# EAGLE design Ardumouse_test (EAGLE 7.6.0)
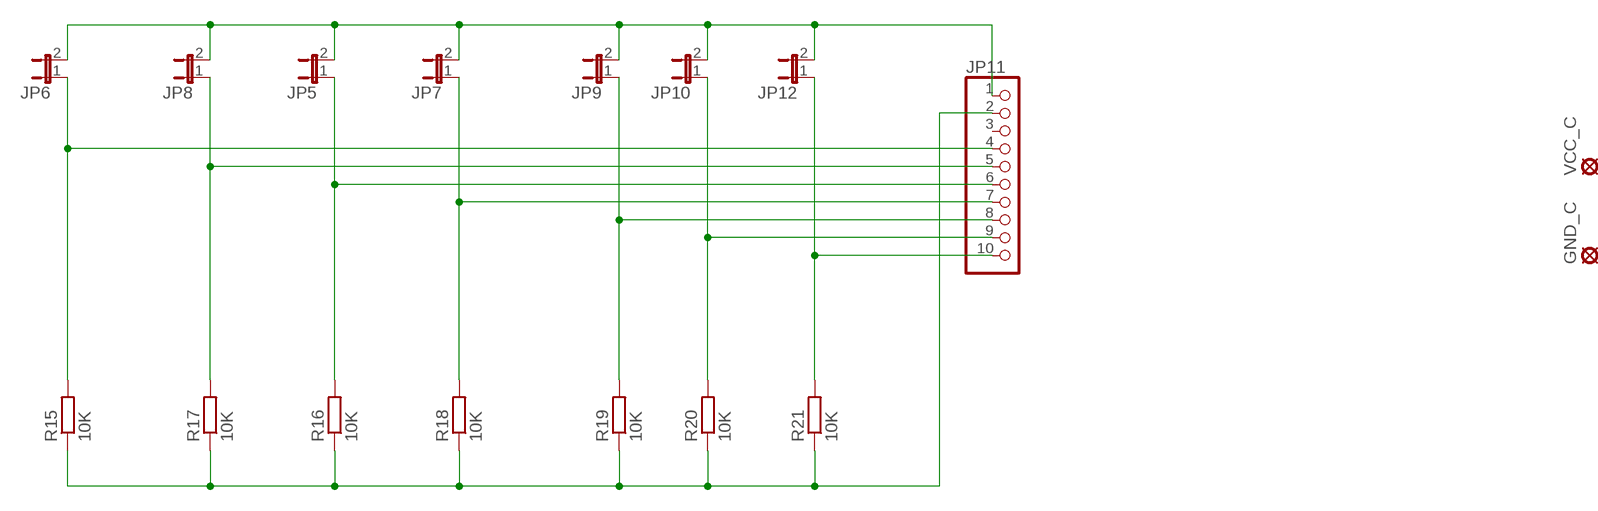
[diagram p0: schematic, sheet 1, part 1 of 2]
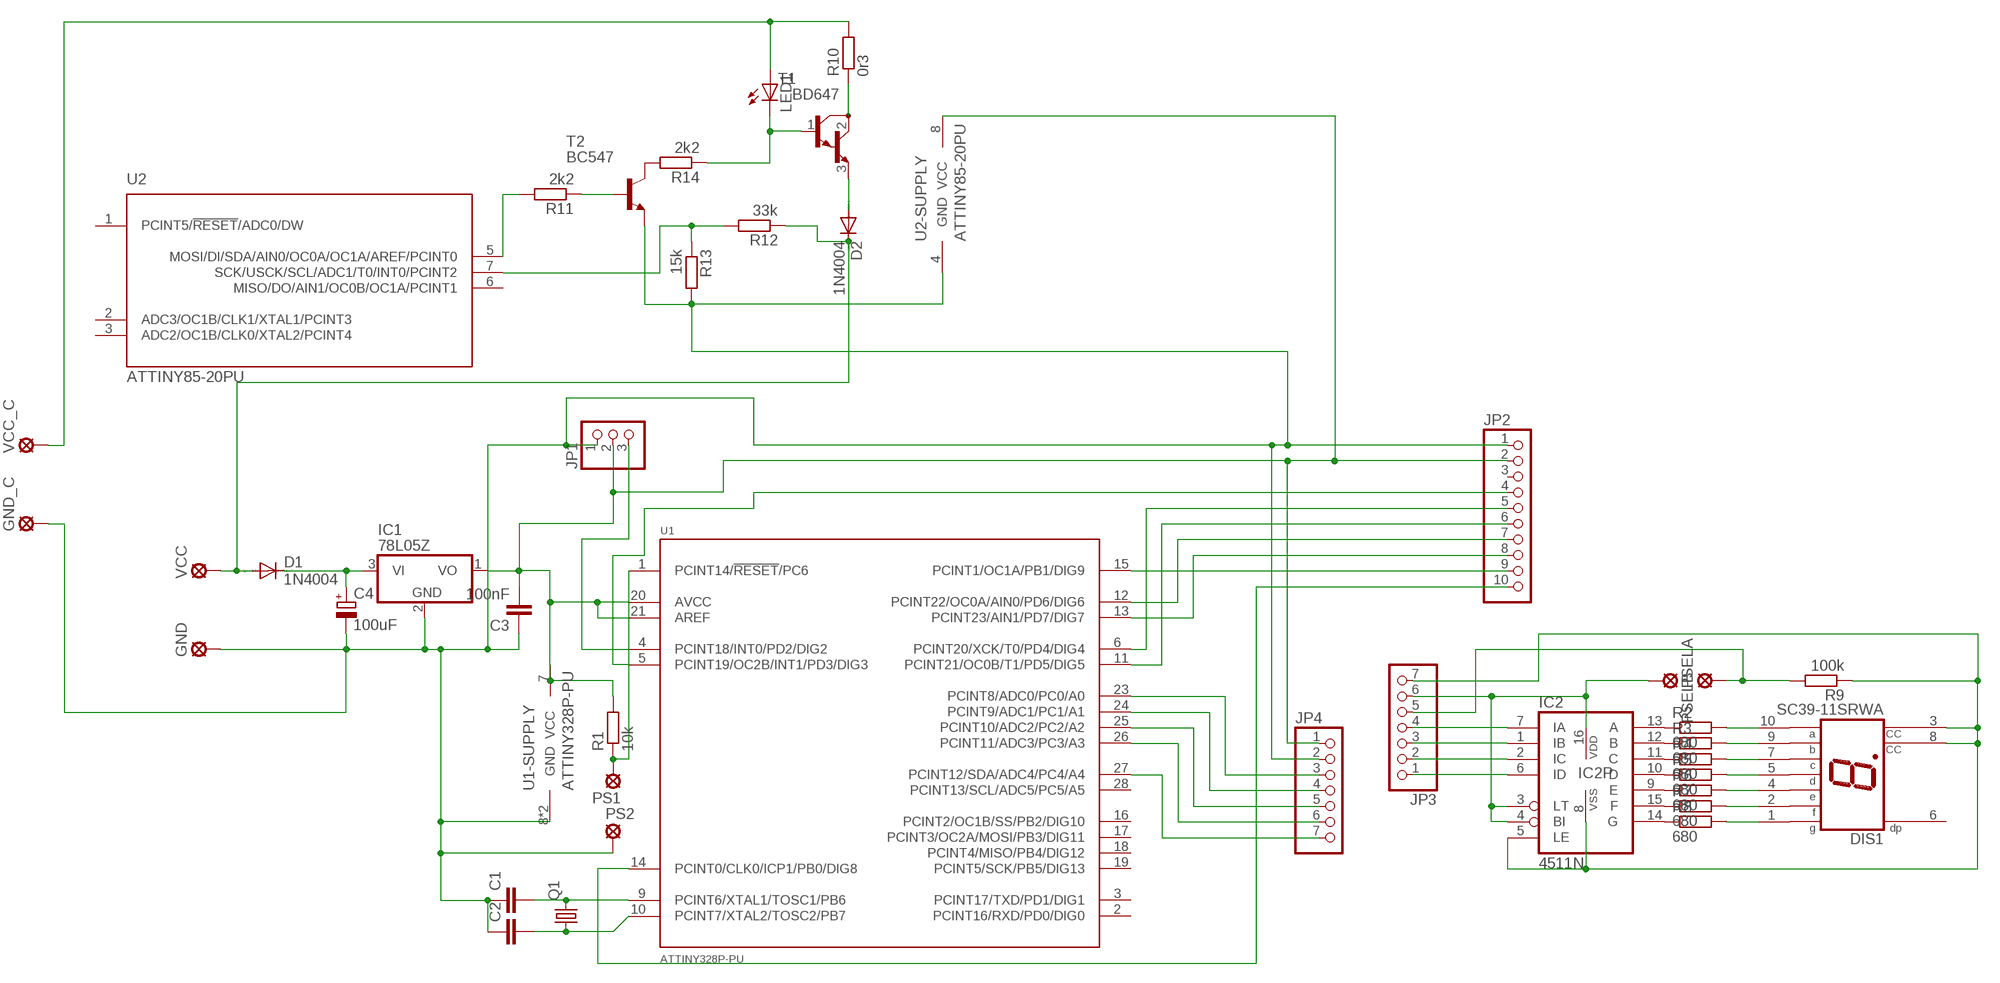
[diagram p1: schematic, sheet 1, part 2 of 2]

## Parts
C1  C2,5-3  [C2.5-3]
C2  C2,5-3  [C2.5-3]
C3  100nF  C2,5-3  [C2.5-3]
C4  100uF  CPOL-EUE3.5-8  [E3,5-8]
D1  1N4004  [DO41-10]
D2  1N4004  [DO41-10]
DIS1  SC39-11SRWA  [HDSP-E]
GND  LSP10  [LSP10]
GND_C  LSP10  [LSP10]
IC1  78L05Z  [TO92]
IC2  4511N  [DIL16]
JP1  PINHD-1X3  [1X03]
JP2  PINHD-1X10  [1X10]
JP3  PINHD-1X7  [1X07]
JP4  PINHD-1X7  [1X07]
JP5  JP1E  [JP1]
JP6  JP1E  [JP1]
JP7  JP1E  [JP1]
JP8  JP1E  [JP1]
JP9  JP1E  [JP1]
JP10  JP1E  [JP1]
JP11  PINHD-1X10  [1X10]
JP12  JP1E  [JP1]
LED1  LED5MM  [LED5MM]
PS1  LSP10  [LSP10]
PS2  LSP10  [LSP10]
PSELA  LSP10  [LSP10]
PSELB  LSP10  [LSP10]
Q1  CRYSTALHC49S  [HC49/S]
R1  10k  R-EU_0204/7  [0204/7]
R2  680  R-EU_0204/7  [0204/7]
R3  680  R-EU_0204/7  [0204/7]
R4  680  R-EU_0204/7  [0204/7]
R5  680  R-EU_0204/7  [0204/7]
R6  680  R-EU_0204/7  [0204/7]
R7  680  R-EU_0204/7  [0204/7]
R8  680  R-EU_0204/7  [0204/7]
R9  100k  R-EU_0204/7  [0204/7]
R10  0r3  R-EU_0204/7  [0204/7]
R11  2k2  R-EU_0204/7  [0204/7]
R12  33k  R-EU_0204/7  [0204/7]
R13  15k  R-EU_0204/7  [0204/7]
R14  2k2  R-EU_0204/7  [0204/7]
R15  10K  R-EU_0204/7  [0204/7]
R16  10K  R-EU_0204/7  [0204/7]
R17  10K  R-EU_0204/7  [0204/7]
R18  10K  R-EU_0204/7  [0204/7]
R19  10K  R-EU_0204/7  [0204/7]
R20  10K  R-EU_0204/7  [0204/7]
R21  10K  R-EU_0204/7  [0204/7]
T1  BD647  [TO220]
T2  BC547  [TO92]
U1  ATTINY328P-PU  [DIP-28]
U2  ATTINY85-20PU  [DIP-8]
VCC  LSP10  [LSP10]
VCC_C  LSP10  [LSP10]

## Nets
N$1: C1.2 Q1.2 U1.9(PCINT6/XTAL1/TOSC1/PB6)
N$2: C2.2 Q1.1 U1.10(PCINT7/XTAL2/TOSC2/PB7)
N$3: D1.A D2.C R12.1 VCC.MP
N$4: C4.+ D1.C IC1.3(VI)
N$5: JP6.1 JP11.4 R15.2
N$6: JP5.1 JP11.6 R16.2
N$7: JP1.3 U1.4(PCINT18/INT0/PD2/DIG2)
N$8: JP2.4 U1.5(PCINT19/OC2B/INT1/PD3/DIG3)
N$9: JP2.5 U1.6(PCINT20/XCK/T0/PD4/DIG4)
N$10: JP2.6 U1.11(PCINT21/OC0B/T1/PD5/DIG5)
N$11: JP2.7 U1.12(PCINT22/OC0A/AIN0/PD6/DIG6)
N$12: JP2.8 U1.13(PCINT23/AIN1/PD7/DIG7)
N$13: JP2.9 U1.15(PCINT1/OC1A/PB1/DIG9)
N$14: JP2.10 U1.14(PCINT0/CLK0/ICP1/PB0/DIG8)
N$15: IC2.13(A) R2.1
N$16: PS1.MP R1.1 U1.1(PCINT14/!RESET!/PC6)
N$17: JP3.5 PSELA.MP R9.2
N$18: DIS1.3(CC) DIS1.8(CC) IC2.5(LE) IC2.8(VSS) JP3.7 R9.1
N$19: IC2.7(IA) JP3.4
N$20: IC2.1(IB) JP3.3
N$21: IC2.12(B) R3.1
N$22: IC2.11(C) R4.1
N$23: IC2.10(D) R5.1
N$24: IC2.9(E) R6.1
N$25: IC2.15(F) R7.1
N$26: IC2.14(G) R8.1
N$27: DIS1.10(A) R2.2
N$28: DIS1.9(B) R3.2
N$29: DIS1.7(C) R4.2
N$30: DIS1.5(D) R5.2
N$31: DIS1.4(E) R6.2
N$32: DIS1.2(F) R7.2
N$33: DIS1.1(G) R8.2
N$34: IC2.2(IC) JP3.2
N$35: IC2.6(ID) JP3.1
N$36: IC2.3(LT) IC2.4(BI) IC2.16(VDD) JP3.6 PSELB.MP
N$37: R12.2 R13.1 U2.7(SCK/USCK/SCL/ADC1/T0/INT0/PCINT2)
N$38: JP4.3 U1.23(PCINT8/ADC0/PC0/A0)
N$39: JP7.1 JP11.7 R18.2
N$40: D2.A T1.3(E)
N$41: JP4.5 U1.25(PCINT10/ADC2/PC2/A2)
N$42: JP4.6 U1.26(PCINT11/ADC3/PC3/A3)
N$43: JP4.7 U1.27(PCINT12/SDA/ADC4/PC4/A4)
N$44: R11.1 T2.2(B)
N$45: JP4.4 U1.24(PCINT9/ADC1/PC1/A1)
N$46: C1.1 C2.1 C3.1 C4.- GND.MP GND_C.MP IC1.2(GND) JP1.1 JP2.1 JP4.2 PS2.MP R13.2 T2.1(E) U1.8(GND) U1.22(GND) U2.4(GND)
N$47: LED1.A R10.2 VCC_C.MP
N$48: LED1.K(C) R14.1 T1.1(B)
N$49: R14.2 T2.3(C)
N$50: R10.1 T1.2(C)
N$51: C3.2 IC1.1(VO) JP1.2 JP2.2 JP4.1 R1.2 U1.7(VCC) U1.20(AVCC) U1.21(AREF) U2.8(VCC)
N$52: R11.2 U2.5(MOSI/DI/SDA/AIN0/OC0A/OC1A/AREF/PCINT0)
N$53: JP8.1 JP11.5 R17.2
N$54: JP9.1 JP11.8 R19.2
N$55: JP10.1 JP11.9 R20.2
N$56: JP11.10 JP12.1 R21.2
N$57: JP11.2 R15.1 R16.1 R17.1 R18.1 R19.1 R20.1 R21.1
N$60: JP5.2 JP6.2 JP7.2 JP8.2 JP9.2 JP10.2 JP11.1 JP12.2
Unconnected: DIS1.6(DP) JP2.3 JP11.3 U1.2(PCINT16/RXD/PD0/DIG0) U1.3(PCINT17/TXD/PD1/DIG1) U1.16(PCINT2/OC1B/SS/PB2/DIG10) U1.17(PCINT3/OC2A/MOSI/PB3/DIG11) U1.18(PCINT4/MISO/PB4/DIG12) U1.19(PCINT5/SCK/PB5/DIG13) U1.28(PCINT13/SCL/ADC5/PC5/A5) U2.1(PCINT5/!RESET!/ADC0/DW) U2.2(ADC3/OC1B/CLK1/XTAL1/PCINT3) U2.3(ADC2/OC1B/CLK0/XTAL2/PCINT4) U2.6(MISO/DO/AIN1/OC0B/OC1A/PCINT1)

## Library data of the parts
C1-C3 = capacitor-wima:C: CAPACITOR naming: grid - package width
C4 = resistor:CPOL-EU: POLARIZED CAPACITOR, European symbol
D1 D2 = diode:1N4004: DIODE general purpose rectifier, 1 A
DIS1 = display-hp:SC39-11SRWA: SINGLE DIGIT NUMERIC DISPLAY 9.9mm (0.39INCH) Source: SC39-11SRWA.pdf; OC_FARNELL: unknown; OC_NEWARK: unknown
GND GND_C PS1 PS2 PSELA PSELB VCC VCC_C = solpad:LSP10: SOLDER PAD drill 1.0 mm, distributor Buerklin, 12H555
IC1 = linear:78*: Positive VOLTAGE REGULATOR Source: http://cache.national.com/ds/LM/LM78L05.pdf http://www.fairchildsemi.com/ds/LM/LM7805.pdf
IC2 = 45xx:4511: BCD to 7-segment LATCH/DECODER/DRIVER
JP1 = pinhead:PINHD-1X3: PIN HEADER
JP2 JP11 = pinhead:PINHD-1X10: PIN HEADER
JP3 JP4 = pinhead:PINHD-1X7: PIN HEADER
JP5-JP10 JP12 = jumper:JP1E: JUMPER
LED1 = led:LED: LED OSRAM: - CHIPLED LG R971, LG N971, LY N971, LG Q971, LY Q971, LO R971, LY R971 LH N974, LH R974 LS Q976, LO Q976, LY Q976 LO Q996 - Hyper CHIPLED LW Q18S LB Q993, LB Q99A, LB R99A - SideLED LS A670, LO A670, LY A670, LG A670, LP A670 LB A673, LV A673, LT A673, LW A673 LH A674 LY A675 LS A676, LA A676, LO A676, LY A676, LW A676 LS A679, LY A679, LG A679 - Hyper Micro SIDELED® LS Y876, LA Y876, LO Y876, LY Y876 LT Y87S - SmartLED LW L88C, LW L88S LB L89C, LB L89S, LG L890 LS L89K, LO L89K, LY L89K LS L896, LA L896, LO L896, LY L896 - TOPLED LS T670, LO T670, LY T670, LG T670, LP T670 LSG T670, LSP T670, LSY T670, LOP T670, LYG T670 LG T671, LOG T671, LSG T671 LB T673, LV T673, LT T673, LW T673 LH T674 LS T676, LA T676, LO T676, LY T676, LB T676, LH T676, LSB T676, LW T676 LB T67C, LV T67C, LT T67C, LS T67K, LO T67K, LY T67K, LW E67C LS E67B, LA E67B, LO E67B, LY E67B, LB E67C, LV E67C, LT E67C LW T67C LS T679, LY T679, LG T679 LS T770, LO T770, LY T770, LG T770, LP T770 LB T773, LV T773, LT T773, LW T773 LH T774 LS E675, LA E675, LY E675, LS T675 LS T776, LA T776, LO T776, LY T776, LB T776 LHGB T686 LT T68C, LB T68C - Hyper Mini TOPLED® LB M676 - Mini TOPLED Santana® LG M470 LS M47K, LO M47K, LY M47K Source: http://www.osram.convergy.de LUXEON: - LUMILED® LXK2-PW12-R00, LXK2-PW12-S00, LXK2-PW14-U00, LXK2-PW14-V00 LXK2-PM12-R00, LXK2-PM12-S00, LXK2-PM14-U00 LXK2-PE12-Q00, LXK2-PE12-R00, LXK2-PE12-S00, LXK2-PE14-T00, LXK2-PE14-U00 LXK2-PB12-K00, LXK2-PB12-L00, LXK2-PB12-M00, LXK2-PB14-N00, LXK2-PB14-P00, LXK2-PB14-Q00 LXK2-PR12-L00, LXK2-PR12-M00, LXK2-PR14-Q00, LXK2-PR14-R00 LXK2-PD12-Q00, LXK2-PD12-R00, LXK2-PD12-S00 LXK2-PH12-R00, LXK2-PH12-S00 LXK2-PL12-P00, LXK2-PL12-Q00, LXK2-PL12-R00 Source: www.luxeon.com KINGBRIGHT: KA-3528ASYC Source: www.kingbright.com
Q1 = crystal:CRYSTAL: CRYSTAL; OC_FARNELL: 1667008; OC_NEWARK: unknown
R1-R8 R10-R14 = resistor:R-EU_: RESISTOR, European symbol
R9 R15-R21 = rcl:R-EU_: RESISTOR, European symbol
T1 = transistor-neu-to92:BD647: NPN BIPOLAR DARLINGTON TRANSISTOR
T2 = transistor:BC547: NPN TRANSISTOR
U1 = volks73-Atmel:ATTINY*8P-?: ATmeag48A/PA/88A/PA/168A/PA/328/P Atmel 8-bit Microcontroller with 4/8/16/32KBytes In-System Programmable Flash Documentation Datasheet <http://www.atmel.com/images/Atmel-8271-8-bit-AVR-Microcontroller-ATmega48A-48PA-88A-88PA-168A-168PA-328-328P_datasheet_Complete.pdf> Features High Performance, Low Power AVR® 8-Bit Microcontroller Advanced RISC Architecture 131 Powerful Instructions – Most Single Clock Cycle Execution 32 x 8 General Purpose Working Registers Fully Static Operation Up to 20 MIPS Throughput at 20MHz On-chip 2-cycle Multiplier High Endurance Non-volatile Memory Segments 4/8/16/32KBytes of In-System Self Programmable Flash program memory 256/512/512/1KBytes EEPROM 512/1K/1K/2KBytes Internal SRAM Write/Erase Cycles: 10,000 Flash/100,000 EEPROM Data Retention: 20 years at 85oC/100 years at 25oC Optional boot Code Section with Independent Lock Bits In-System Programming by On-chip Boot Program True Read-While-Write Operation Atmel® QTouch® library support Capacitive touch buttons, silders and wheels QTouch and QMatrix® acquisition Up to 64 sense channels Peripheral Features Two 8-bit Timer/Counters with Separate Prescaler and Compare Mode One 16-bit Timer/Counter with Separate Prescaler, Compare Mode, and Capture Mode Real Time Counter with Separate Oscillator Six PWM Channels 8-channel 10-bit ADC in TQFP and QFN/MLF package Temperature Measurement 6-channel 10-bit ADC in PDIP Package Temperature Measurement Programmable Serial USART Master/Slave SPI Serial Interface Byte-oriented 2-wire Serial Interface (Philips I2C compatible) Programmable Watchdog Timer with Separate On-chip Oscillator On-chip Analog Comparator Interrupt and Wake-up on Pin Change Special Microcontroller Features Power-on Reset and Programmable Brown-out Detection Internal Calibrated Oscillator External and Internal Interrupt Sources Six Sleep Modes: Idle, ADC Noise Reduction, Power-save, Power-down, Standby, and Extended Standby I/O and Packages 23 Programmable I/O Lines 28-pin PDIP, 32-lead TQFP, 28-pad QFN/MLF and 32-pad QFN/MLF Operating Voltage: 1.8 - 5.5V Temperature Range: -40oC to 85oC Speed Grade: 0 - 4MHz@1.8 - 5.5V, 0 - 10MHz@2.7 - 5.5.V, 0 - 20MHz @ 4.5 - 5.5V Power Consumption at 1MHz, 1.8V, 25oC Active Mode: 0.2mA Power-down Mode: 0.1μA Power-save Mode: 0.75μA (Including 32kHz RTC); CATEGORY: Integrated Circuits (ICs); CONNECTIVITY: I²C, SPI, UART/USART; CORE_PROCESSOR: AVR; CORE_SIZE: 8-Bit; DATA_CONVERTERS: A/D 6x10b; DESCRIPTION: IC MCU 8BIT 32KB FLASH 28DIP; DOCUMENTATION_LINK: <a href="http://www.atmel.com/images/Atmel-8271-8-bit-AVR-Microcontroller-ATmega48A-48PA-88A-88PA-168A-168PA-328-328P_datasheet_Complete.pdf">Datasheet</a>; DOCUMENTATION_URL: http://www.atmel.com/images/Atmel-8271-8-bit-AVR-Microcontroller-ATmega48A-48PA-88A-88PA-168A-168PA-328-328P_datasheet_Complete.pdf; EEPROM_SIZE: 1K x 8; FAMILY: Embedded - Microcontrollers; MANUFACTURER: Atmel; NUMBER_OF_IO: 23; OPERATING_TEMPERATURE: -40°C ~ 85°C; OSCILLATOR_TYPE: Internal; PACKAGE: 28-DIP (0.300", 7.62mm); PART_NUMBER: ATMEGA328P-PU; PERIPHERALS: Brown-out Detect/Reset, POR, PWM, WDT; PROGRAM_MEMORY_SIZE: 32KB (16K x 16); PROGRAM_MEMORY_TYPE: FLASH; RAM_SIZE: 2K x 8; SERIES: AVR® ATmega; SPEED: 20MHz; SUPPLIER_DEVICE_PACKAGE: 28-PDIP; SUPPLIER_ITEM_LINK: <a href="http://www.digikey.com/product-detail/en/ATMEGA328P-PU/ATMEGA328P-PU-ND/1914589">Details</a>; SUPPLIER_ITEM_NUMBER: ATMEGA328P-PU-ND; SUPPLIER_ITEM_URL: http://www.digikey.com/product-detail/en/ATMEGA328P-PU/ATMEGA328P-PU-ND/1914589; SUPPLIER_LINK: <a href="http://www.digikey.com">Home Page</a>; SUPPLIER_NAME: Digi-Key; SUPPLIER_URL: http://www.digikey.com; VOLTAGE-SUPPLY: 1.8 V ~ 5.5 V
U2 = volks73-Atmel:ATTINY*5-?: AVR® ATtiny2/4/85 Microcontroller Atmel 8-bit AVR Microcontroller with 2/4/8K Bytes In-System Programmable Flash Documentation Datasheet <http://www.atmel.com/images/atmel-2586-avr-8-bit-microcontroller-attiny25-attiny45-attiny85_datasheet.pdf> Features High Performance, Low Power AVR® 8-Bit Microcontroller Advanced RISC Architecture 120 Powerful Instructions – Most Single Clock Cycle Execution 32 x 8 General Purpose Working Registers Fully Static Operation Non-volatile Program and Data Memories 2/4/8K Bytes of In-System Programmable Program Memory Flash Endurance: 10,000 Write/Erase Cycles 128/256/512 Bytes In-System Programmable EEPROM Endurance: 100,000 Write/Erase Cycles 128/256/512 Bytes Internal SRAM Programming Lock for Self-Programming Flash Program and EEPROM Data Security Peripheral Features 8-bit Timer/Counter with Prescaler and Two PWM Channels 8-bit High Speed Timer/Counter with Separate Prescaler 2 High Frequency PWM Outputs with Separate Output Compare Registers Programmable Dead Time Generator USI – Universal Serial Interface with Start Condition Detector 10-bit ADC 4 Single Ended Channels 2 Differential ADC Channel Pairs with Programmable Gain (1x, 20x) Temperature Measurement Programmable Watchdog Timer with Separate On-chip Oscillator On-chip Analog Comparator Special Microcontroller Features debugWIRE On-chip Debug System In-System Programmable via SPI Port External and Internal Interrupt Sources Low Power Idle, ADC Noise Reduction, and Power-down Modes Enhanced Power-on Reset Circuit Programmable Brown-out Detection Circuit Internal Calibrated Oscillator I/O and Packages Six Programmable I/O Lines 8-pin PDIP, 8-pin SOIC, 20-pad QFN/MLF, and 8-pin TSSOP (only ATtiny45/V) Operating Voltage 1.8 - 5.5V for ATtiny25V/45V/85V 2.7 - 5.5V for ATtiny25/45/85 Speed Grade ATtiny25V/45V/85V: 0 – 4 MHz @ 1.8 - 5.5V, 0 - 10 MHz @ 2.7 - 5.5V ATtiny25/45/85: 0 – 10 MHz @ 2.7 - 5.5V, 0 - 20 MHz @ 4.5 - 5.5V Industrial Temperature Range Low Power Consumption Active Mode: 1 MHz, 1.8V: 300 μA Power-down Mode: 0.1 μA at 1.8V; CONNECTIVITY: USI; CORE_PROCESSOR: AVR; CORE_SIZE: 8-Bit; DATA_CONVERTERS: A/D 4x10b; DESCRIPTION: IC MCU 8BIT 8KB FLASH 8DIP; DOCUMENTATION_LINK: <a href="http://www.atmel.com/images/atmel-2586-avr-8-bit-microcontroller-attiny25-attiny45-attiny85_datasheet.pdf">Datasheet</a>; DOCUMENTATION_URL: http://www.atmel.com/images/atmel-2586-avr-8-bit-microcontroller-attiny25-attiny45-attiny85_datasheet.pdf; EEPROM_SIZE: 512 x 8; MANUFACTURER: Atmel; NUMBER_OF_IO: 6; OPERATING_TEMPERATURE: -40C ~ 85C; OSCILLATOR_TYPE: Internal; PACKAGE: 8-DIP (0.300", 7.62mm); PART_NUMBER: ATTINY85-20PU; PERIPHERALS: Brown-out Detect/Reset, POR, PWM, WDT; PROGRAM_MEMORY_SIZE: 8KB (4K x 16); PROGRAM_MEMORY_TYPE: FLASH; RAM_SIZE: 512 x 8; SPEED: 20MHz; SUPPLIER_DEVICE_PACKAGE: 8-PDIP; SUPPLIER_ITEM_LINK: <a href="http://www.digikey.com/product-detail/en/ATTINY85-20PU/ATTINY85-20PU-ND/735469">Details</a>; SUPPLIER_ITEM_NUMBER: ATTINY85-20PU-ND; SUPPLIER_ITEM_URL: http://www.digikey.com/product-detail/en/ATTINY85-20PU/ATTINY85-20PU-ND/735469; SUPPLIER_LINK: <a href="http://www.digikey.com">Home Page</a>; SUPPLIER_NAME: Digi-Key; SUPPLIER_URL: http://www.digikey.com; VOLTAGE-SUPPLY: 2.7 ~ 5.5V

## Board
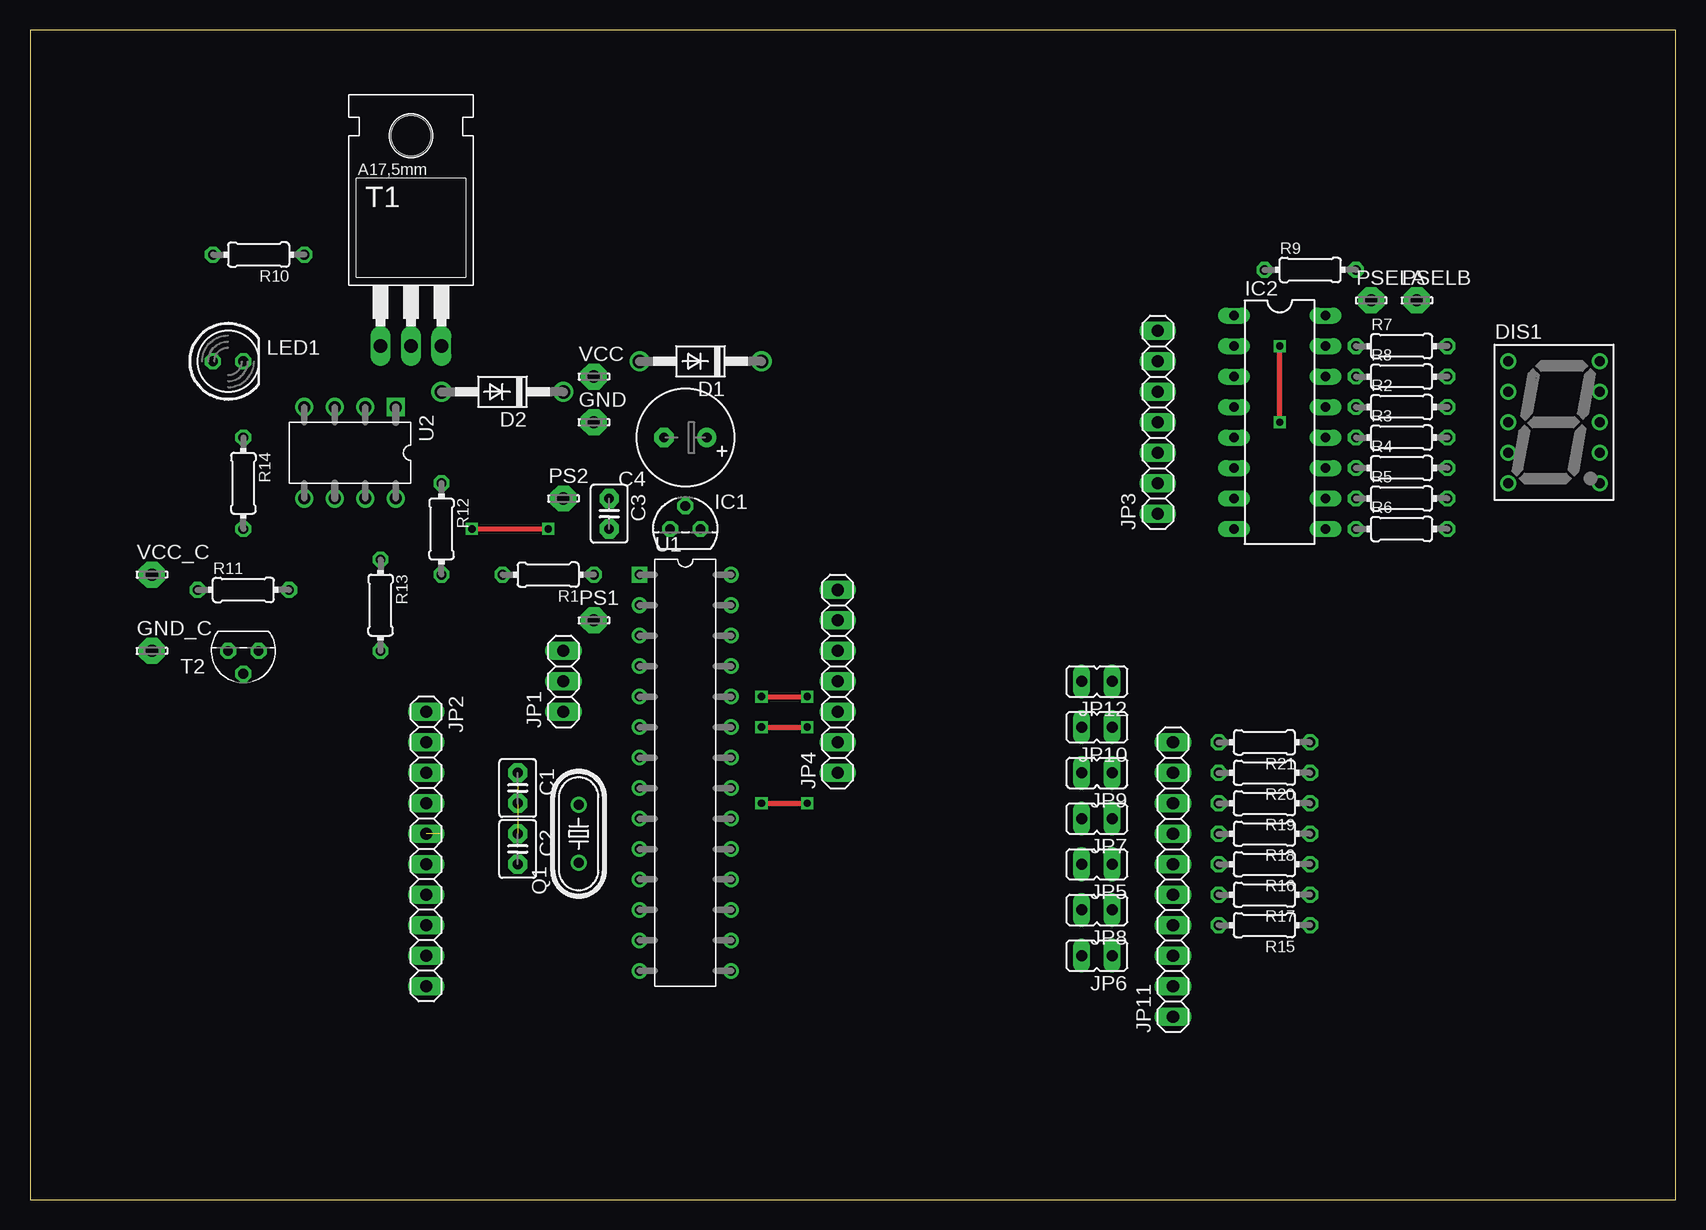
[diagram p2: board, top side]
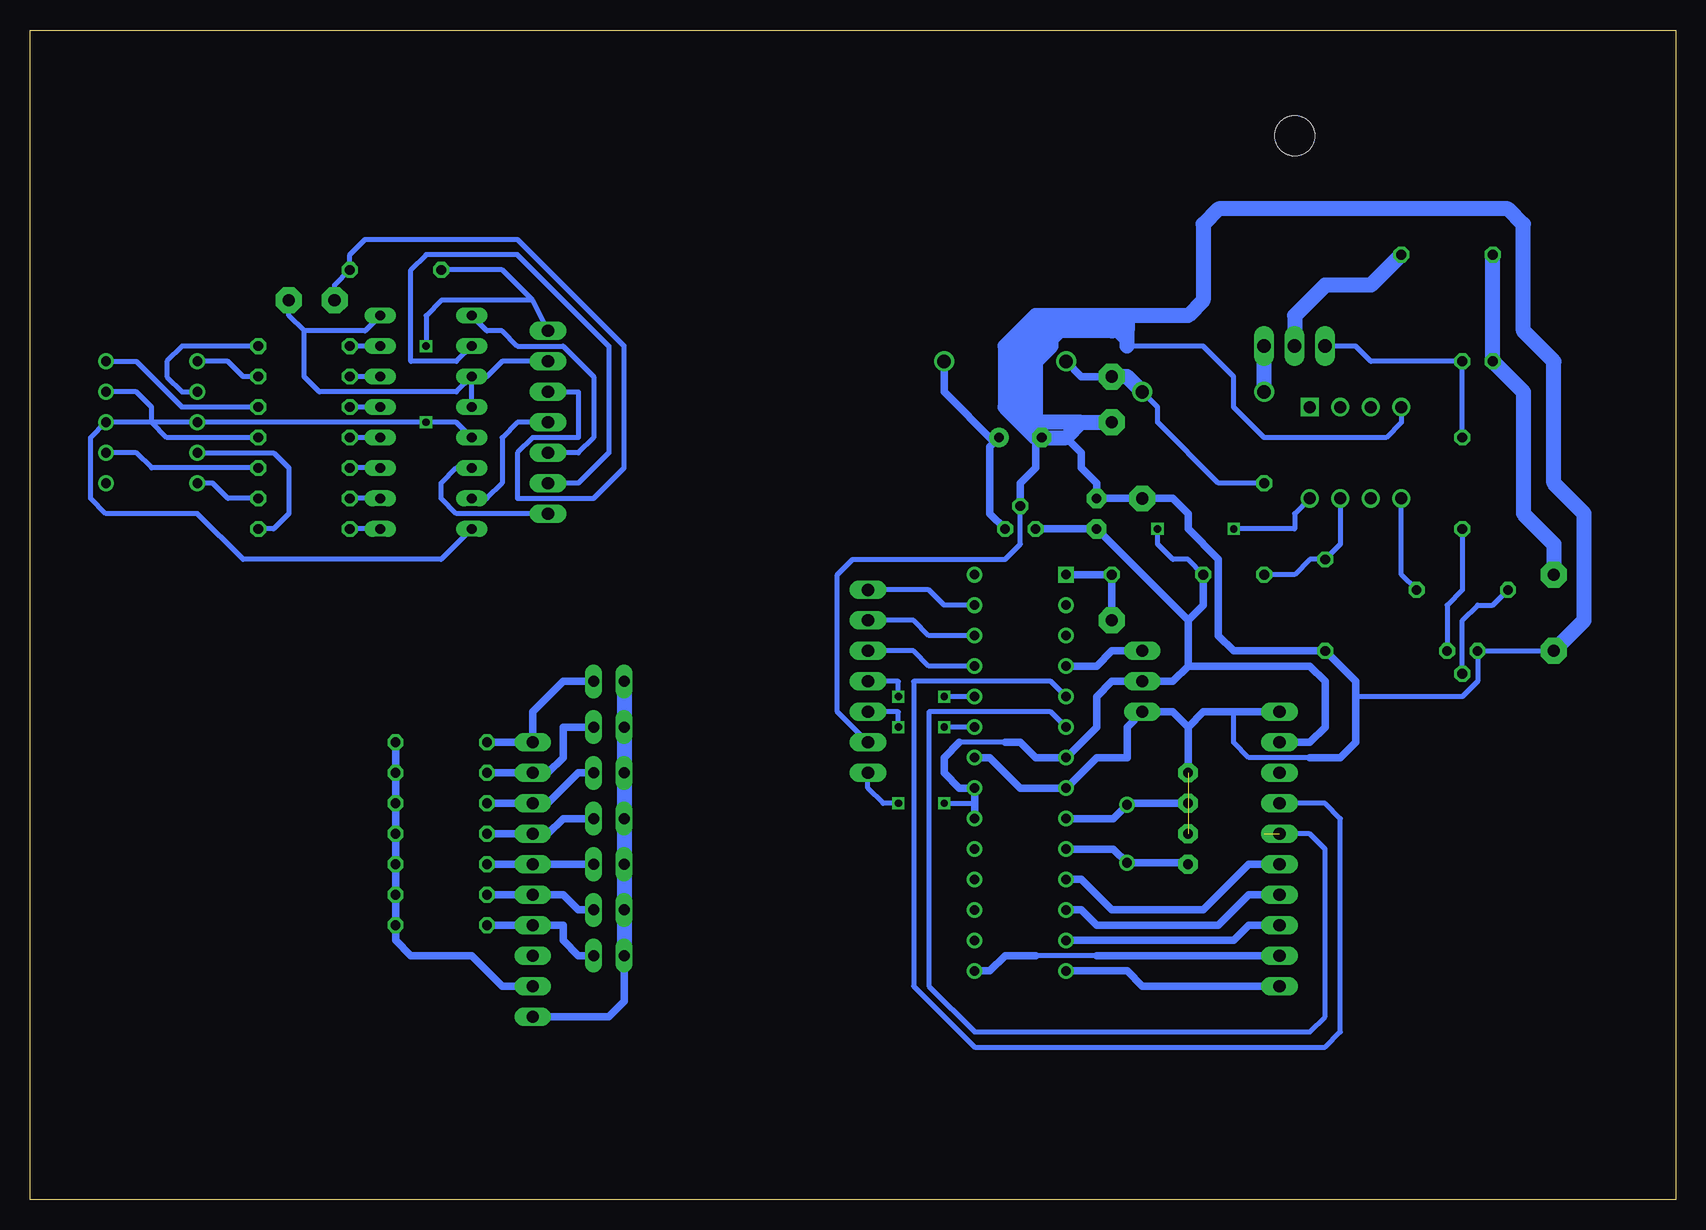
[diagram p3: board, bottom side, seen from below]

Size 137.14 x 97.46 mm. Coordinates in mm from the lower left corner, seen from the top.
Outline: 0,0 137.14,0 137.14,97.46 0,97.46 0,0
Copper layers (1*16): Top 0.035mm / dielectric 1.5mm / Bottom 0.035mm
Design rules "default": minimum track width 10mil, minimum drill 24mil, track to track 8mil, track to pad 8mil, pad to pad 8mil, via to via 8mil, smd to smd 8mil, copper to edge 40mil, drill to drill 8mil, minimum pad ring 10mil, minimum via ring 8mil, stop-mask expansion 4mil, vias tented up to drill 0mil, thermal gap 10mil

### Footprints (pad centres in the part's own frame; a part is rotated, then mirrored left to right if it is on the bottom)
C2.5-3 = drill 0.813 pad 1.6 octagon: 1 -1.27,0; 2 1.27,0
E3,5-8 = drill 0.813 pad 1.6: + -1.778,0 | drill 0.813 pad 1.6 octagon: - 1.778,0
DO41-10 = drill 1.118: A 5.08,0; C -5.08,0
HDSP-E = drill 0.813: 1 -3.81,5.08; 2 -3.81,2.54; 3 -3.81,0; 4 -3.81,-2.54; 5 -3.81,-5.08; 6 3.81,-5.08; 7 3.81,-2.54; 8 3.81,0; 9 3.81,2.54; 10 3.81,5.08
LSP10 = drill 1.016 pad 2.159 octagon: MP 0,0
TO92 = drill 0.813 octagon: 1 -1.27,0; 2 0,1.905; 3 1.27,0
DIL16 = drill 0.813 long: 1 -8.89,-3.81; 2 -6.35,-3.81; 3 -3.81,-3.81; 4 -1.27,-3.81; 5 1.27,-3.81; 6 3.81,-3.81; 7 6.35,-3.81; 8 8.89,-3.81; 9 8.89,3.81; 10 6.35,3.81; 11 3.81,3.81; 12 1.27,3.81; 13 -1.27,3.81; 14 -3.81,3.81; 15 -6.35,3.81; 16 -8.89,3.81
1X03 = drill 1.016 long: 1 -2.54,0; 2 0,0; 3 2.54,0
1X10 = drill 1.016 long: 1 -11.43,0; 2 -8.89,0; 3 -6.35,0; 4 -3.81,0; 5 -1.27,0; 6 1.27,0; 7 3.81,0; 8 6.35,0; 9 8.89,0; 10 11.43,0
1X07 = drill 1.016 long: 1 -7.62,0; 2 -5.08,0; 3 -2.54,0; 4 0,0; 5 2.54,0; 6 5.08,0; 7 7.62,0
JP1 = drill 0.914 long: 1 0,-1.27; 2 0,1.27
LED5MM = drill 0.813 octagon: A -1.27,0; K 1.27,0
HC49/S = drill 0.813: 1 -2.413,0; 2 2.413,0
0204/7 = drill 0.813 octagon: 1 -3.81,0; 2 3.81,0
TO220 = drill 1.118 long: 1 -2.54,-6.35; 2 0,-6.35; 3 2.54,-6.35 | hole 3.302: 0,11.176
TO92' = drill 0.813 octagon: 1 1.27,0; 2 0,1.905; 3 -1.27,0
DIP-28 = drill 0.8 square: 1 -3.81,16.51 | drill 0.8: 2 -3.81,13.97; 3 -3.81,11.43; 4 -3.81,8.89; 5 -3.81,6.35; 6 -3.81,3.81; 7 -3.81,1.27; 8 -3.81,-1.27; 9 -3.81,-3.81; 10 -3.81,-6.35; 11 -3.81,-8.89; 12 -3.81,-11.43; 13 -3.81,-13.97; 14 -3.81,-16.51; 15 3.81,-16.51; 16 3.81,-13.97; 17 3.81,-11.43; 18 3.81,-8.89; 19 3.81,-6.35; 20 3.81,-3.81; 21 3.81,-1.27; 22 3.81,1.27; 23 3.81,3.81; 24 3.81,6.35; 25 3.81,8.89; 26 3.81,11.43; 27 3.81,13.97; 28 3.81,16.51
DIP-8 = drill 1 square: 1 -3.81,3.81 | drill 1: 2 -3.81,1.27; 3 -3.81,-1.27; 4 -3.81,-3.81; 5 3.81,-3.81; 6 3.81,-1.27; 7 3.81,1.27; 8 3.81,3.81

### Placement (x,y rotation side)
C1  40.64,34.29 270 top
C2  40.64,29.21 270 top
C3  48.26,57.15 270 top
C4  54.61,63.5 180 top
D1  55.88,69.85 180 top
D2  39.37,67.31 180 top
DIS1  127,64.77 0 top
GND  46.99,64.77 0 top
GND_C  10.16,45.72 0 top
IC1  54.61,55.88 0 top
IC2  104.14,64.77 270 top
JP1  44.45,43.18 90 top
JP2  33.02,29.21 270 top
JP3  93.98,64.77 90 top
JP4  67.31,43.18 90 top
JP5  88.9,27.94 90 top
JP6  88.9,20.32 90 top
JP7  88.9,31.75 90 top
JP8  88.9,24.13 90 top
JP9  88.9,35.56 90 top
JP10  88.9,39.37 90 top
JP11  95.25,26.67 90 top
JP12  88.9,43.18 90 top
LED1  16.51,69.85 0 top
PS1  46.99,48.26 0 top
PS2  44.45,58.42 0 top
PSELA  111.76,74.93 0 top
PSELB  115.57,74.93 0 top
Q1  45.72,30.48 90 top
R1  43.18,52.07 180 top
R2  114.3,66.04 0 top
R3  114.3,63.5 0 top
R4  114.3,60.96 0 top
R5  114.3,58.42 0 top
R6  114.3,55.88 0 top
R7  114.3,71.12 0 top
R8  114.3,68.58 0 top
R9  106.68,77.47 0 top
R10  19.05,78.74 180 top
R11  17.78,50.8 0 top
R12  34.29,55.88 270 top
R13  29.21,49.53 270 top
R14  17.78,59.69 270 top
R15  102.87,22.86 180 top
R16  102.87,27.94 180 top
R17  102.87,25.4 180 top
R18  102.87,30.48 180 top
R19  102.87,33.02 180 top
R20  102.87,35.56 180 top
R21  102.87,38.1 180 top
T1  31.75,77.47 0 top
T2  BC547  [TO92']  17.78,45.72 180 top
U1  54.61,35.56 0 top
U2  26.67,62.23 270 top
VCC  46.99,68.58 0 top
VCC_C  10.16,52.07 0 top

### Tracks (layer width: path | path; a pad name or v marks a point on that pad's centre or on a via)
N$1
  Bottom 0.61: U1.9 46.86,31.75 Q1.2 45.59,33.02 C1.2
N$2
  Bottom 0.61: U1.10 46.86,29.21 Q1.1 40.77,28.07 C2.2
N$3
  Bottom 0.406: R12.1 38.1,59.69 43.18,64.77 43.18,66.04 D2.C
  Bottom 0.61: VCC.MP 49.53,68.58 D1.A
  Bottom 1.27: D2.C 45.72,68.58 VCC.MP
N$4
  Bottom 0.61: C4.+ 56.77,63.12 | 56.77,63.12 57.15,62.74 57.15,57.15 IC1.3 | D1.C 60.96,67.31 56.77,63.12
N$5
  Bottom 0.61: JP6.1 91.44,20.32 92.71,21.59 92.71,22.86 JP11.4 R15.2
N$6
  Bottom 0.61: JP5.1 JP11.6 R16.2
N$7
  Bottom 0.61: JP1.3 46.99,45.72 48.26,44.45 U1.4
N$8
  Bottom 0.406: U1.5 52.07,43.18 63.5,43.18 63.5,17.78 58.42,12.7 29.21,12.7 27.94,13.97 27.94,31.75 29.21,33.02 JP2.4
N$9  (1 unrouted)
  Bottom 0.406: U1.6 52.07,40.64 62.23,40.64 62.23,17.78 58.42,13.97 30.48,13.97 29.21,15.24 29.21,29.21 30.48,30.48 34.29,30.48
N$10
  Bottom 0.61: JP2.6 35.56,27.94 39.37,24.13 46.99,24.13 49.53,26.67 U1.11
N$11
  Bottom 0.61: JP2.7 35.56,25.4 38.1,22.86 48.26,22.86 49.53,24.13 U1.12
N$12
  Bottom 0.61: JP2.8 35.56,22.86 36.83,21.59 U1.13
N$13
  Bottom 0.406: 48.26,20.32 53.34,20.32
  Bottom 0.61: JP2.9 48.26,20.32 | 53.34,20.32 55.88,20.32 57.15,19.05 U1.15
N$14
  Bottom 0.61: JP2.10 44.45,17.78 45.72,19.05 U1.14
N$15
  Bottom 0.406: IC2.13 R2.1
N$16
  Bottom 0.61: U1.1 R1.1 PS1.MP
N$17
  Bottom 0.406: PSELA.MP 111.76,76.2 R9.2 110.49,78.74 109.22,80.01 96.52,80.01 87.63,71.12 87.63,60.96 90.17,58.42 96.52,58.42 96.52,62.23 95.25,63.5 91.44,63.5 91.44,67.31 JP3.5
N$18  (via drill 0.6)
  Top 0.406: v104.14,64.77 v104.14,71.12
  Bottom 0.406: 95.25,74.93 97.79,77.47 R9.1 | IC2.5 101.6,64.77 v104.14,64.77 DIS1.3 DIS1.8 132.08,63.5 132.08,58.42 130.81,57.15 123.19,57.15 119.38,53.34 102.87,53.34 IC2.8 | JP3.7 95.25,74.93 | 95.25,74.93 102.87,74.93 104.14,73.66 v104.14,71.12
N$19
  Bottom 0.406: JP3.4 96.52,64.77 97.79,63.5 97.79,59.69 99.06,58.42 IC2.7
N$20
  Bottom 0.406: IC2.1 99.06,72.39 97.79,72.39 96.52,71.12 92.71,71.12 90.17,68.58 90.17,63.5 91.44,62.23 JP3.3
N$21
  Bottom 0.406: IC2.12 R3.1
N$22
  Bottom 0.406: IC2.11 R4.1
N$23
  Bottom 0.406: IC2.10 R5.1
N$24
  Bottom 0.406: IC2.9 R6.1
N$25
  Bottom 0.406: IC2.15 R7.1
N$26
  Bottom 0.406: IC2.14 R8.1
N$27
  Bottom 0.406: R2.2 124.46,66.04 128.27,69.85 DIS1.10
N$28
  Bottom 0.406: R3.2 125.73,63.5 127,64.77 127,66.04 128.27,67.31 DIS1.9
N$29
  Bottom 0.406: R4.2 127,60.96 128.27,62.23 DIS1.7
N$30
  Bottom 0.406: R5.2 120.65,58.42 121.92,59.69 DIS1.5
N$31
  Bottom 0.406: DIS1.4 116.84,62.23 115.57,60.96 115.57,57.15 116.84,55.88 R6.2
N$32
  Bottom 0.406: R7.2 124.46,71.12 125.73,69.85 125.73,68.58 124.46,67.31 DIS1.2
N$33
  Bottom 0.406: R8.2 119.38,68.58 120.65,69.85 DIS1.1
N$34
  Bottom 0.406: IC2.2 101.6,69.85 105.41,69.85 105.41,77.47 104.14,78.74 96.52,78.74 88.9,71.12 88.9,62.23 91.44,59.69 JP3.2
N$35
  Bottom 0.406: JP3.1 101.6,57.15 102.87,58.42 102.87,59.69 101.6,60.96 IC2.6
N$36
  Bottom 0.406: IC2.4 IC2.3 | JP3.6 97.79,69.85 99.06,68.58 IC2.3 | IC2.16 109.22,72.39 114.3,72.39 | 114.3,72.39 115.57,73.66 PSELB.MP | IC2.3 101.6,67.31 113.03,67.31 114.3,68.58 114.3,72.39
N$37
  Bottom 0.406: U2.7 27.94,54.61 R13.1 30.48,53.34 31.75,52.07 R12.2
N$38  (via drill 0.6)
  Top 0.406: v60.96,39.37 v64.77,39.37
  Bottom 0.406: v64.77,39.37 64.77,40.64 JP4.3 | U1.23 v60.96,39.37
N$39
  Bottom 0.61: JP7.1 92.71,31.75 93.98,30.48 JP11.7 R18.2
N$40
  Bottom 1.27: D2.A T1.3
N$41
  Bottom 0.406: U1.25 62.23,44.45 63.5,45.72 JP4.5
N$42
  Bottom 0.406: U1.26 62.23,46.99 63.5,48.26 JP4.6
N$43
  Bottom 0.406: U1.27 60.96,49.53 62.23,50.8 JP4.7
N$44
  Bottom 0.406: T2.2 17.78,48.26 16.51,49.53 15.24,49.53 R11.1
N$45  (via drill 0.6)
  Top 0.406: v60.96,41.91 v64.77,41.91
  Bottom 0.406: v64.77,41.91 64.77,43.18 JP4.4 | U1.24 v60.96,41.91
N$46  (1 unrouted)
  Bottom 0.406: 30.48,36.83 35.56,36.83 36.83,38.1 36.83,40.64 | JP4.2 69.85,40.64 69.85,52.07 68.58,53.34 55.88,53.34 54.61,54.61 IC1.2 | GND_C.MP T2.1 16.51,43.18 17.78,41.91 26.67,41.91 | U2.4 22.86,64.77 24.13,63.5 34.29,63.5 36.83,66.04 36.83,68.58 39.37,71.12 45.72,71.12 46.99,72.39 50.8,72.39 52.07,71.12 | 53.34,64.77 53.34,63.5
  Bottom 0.61: C4.- 50.8,63.5 49.53,62.23 49.53,60.96 48.26,59.69 C3.1 PS2.MP 41.91,58.42 40.64,57.15 40.64,55.88 38.1,53.34 38.1,46.99 36.83,45.72 R13.2 26.67,43.18 26.67,41.91 26.67,38.1 27.94,36.83 30.48,36.83 | C4.- 53.34,63.5 | C4.- 53.34,62.99 53.34,60.96 54.61,59.69 IC1.2 | 40.64,39.37 41.91,40.64 JP1.1 45.72,39.37 45.72,36.83 48.26,36.83 U1.8 54.61,34.29 57.15,36.83 U1.22 | 40.64,39.37 C1.1 | JP2.1 36.83,40.64 39.37,40.64 40.64,39.37
  Bottom 1.27: GND_C.MP 7.62,48.26 7.62,57.15 10.16,59.69 10.16,69.85 12.7,72.39 12.7,81.28 13.97,82.55 38.1,82.55 39.37,81.28 39.37,74.93 40.64,73.66 45.72,73.66 | 45.72,73.66 53.34,73.66 55.88,71.12 55.88,66.04 54.61,64.77 | 54.61,64.77 53.34,63.5 50.8,63.5 49.53,64.77 | 49.53,64.77 GND.MP | 46.99,72.39 52.07,72.39 | 52.07,72.39 53.34,72.39 54.61,71.12 54.61,64.77 | 54.61,64.77 53.34,64.77 | 53.34,64.77 53.34,69.85 | 53.34,69.85 53.34,71.12 52.07,72.39 | 52.07,72.39 52.07,71.12 53.34,69.85 | 49.53,64.77 53.34,64.77 | 45.72,71.12 45.72,72.39 | 45.72,72.39 46.99,72.39 | 46.99,72.39 45.72,73.66 | 45.72,73.66 45.72,72.39
N$47
  Bottom 1.27: VCC_C.MP 10.16,54.61 12.7,57.15 12.7,67.31 LED1.A R10.2
N$48
  Bottom 0.406: T1.1 26.67,71.12 25.4,69.85 LED1.K R14.1
N$49
  Bottom 0.406: R14.2 17.78,50.8 19.05,49.53 T2.3
N$50
  Bottom 1.27: R10.1 25.4,76.2 29.21,76.2 31.75,73.66 T1.2
N$51  (via drill 0.6)
  Top 0.406: v60.96,33.02 v64.77,33.02 | v36.83,55.88 v43.18,55.88
  Bottom 0.406: v64.77,33.02 66.04,33.02 67.31,34.29 JP4.1 | 55.88,38.1 59.69,38.1 | v60.96,33.02 58.42,33.02 | U2.8 31.75,57.15 31.75,55.88 v36.83,55.88 | R1.2 40.64,53.34 41.91,53.34 43.18,54.61 v43.18,55.88
  Bottom 0.61: IC1.1 C3.2 40.64,48.26 | 40.64,44.45 41.91,43.18 JP1.2 46.99,43.18 48.26,41.91 48.26,39.37 U1.7 53.34,36.83 54.61,38.1 55.88,38.1 | 40.64,44.45 40.64,48.26 | JP2.2 30.48,38.1 29.21,39.37 29.21,43.18 30.48,44.45 40.64,44.45 | R1.2 39.37,49.53 40.64,48.26 | U1.20 58.42,33.02 U1.21 59.69,34.29 60.96,35.56 60.96,36.83 59.69,38.1
N$52
  Bottom 0.406: R11.2 22.86,52.07 U2.5
N$53
  Bottom 0.61: JP8.1 91.44,24.13 92.71,25.4 JP11.5 R17.2
N$54
  Bottom 0.61: JP9.1 91.44,35.56 93.98,33.02 JP11.8 R19.2
N$55
  Bottom 0.61: JP10.1 92.71,39.37 92.71,36.83 93.98,35.56 JP11.9 R20.2
N$56
  Bottom 0.61: JP12.1 92.71,43.18 95.25,40.64 JP11.10 R21.2
N$57
  Bottom 0.61: JP11.2 97.79,17.78 100.33,20.32 105.41,20.32 106.68,21.59 R15.1 R17.1 R16.1 R18.1 R19.1 R20.1 R21.1
N$60
  Bottom 0.61: JP6.2 87.63,16.51 88.9,15.24 JP11.1
  Bottom 1.27: JP12.2 JP10.2 JP9.2 JP7.2 JP5.2 JP8.2 JP6.2